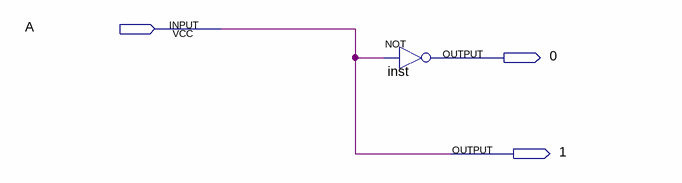
[diagram p0: schematic sheet]
// Quartus schematic 1-to-2_decoder.bdf as structural Verilog: 1 symbols, 3 pins
module \1-to-2_decoder  (
  input  A,
  output \0 ,
  output \1 
);

  not inst (\0 , A);

  assign \1  = A;
endmodule
